# Altium project Micron-6.PrjPcb
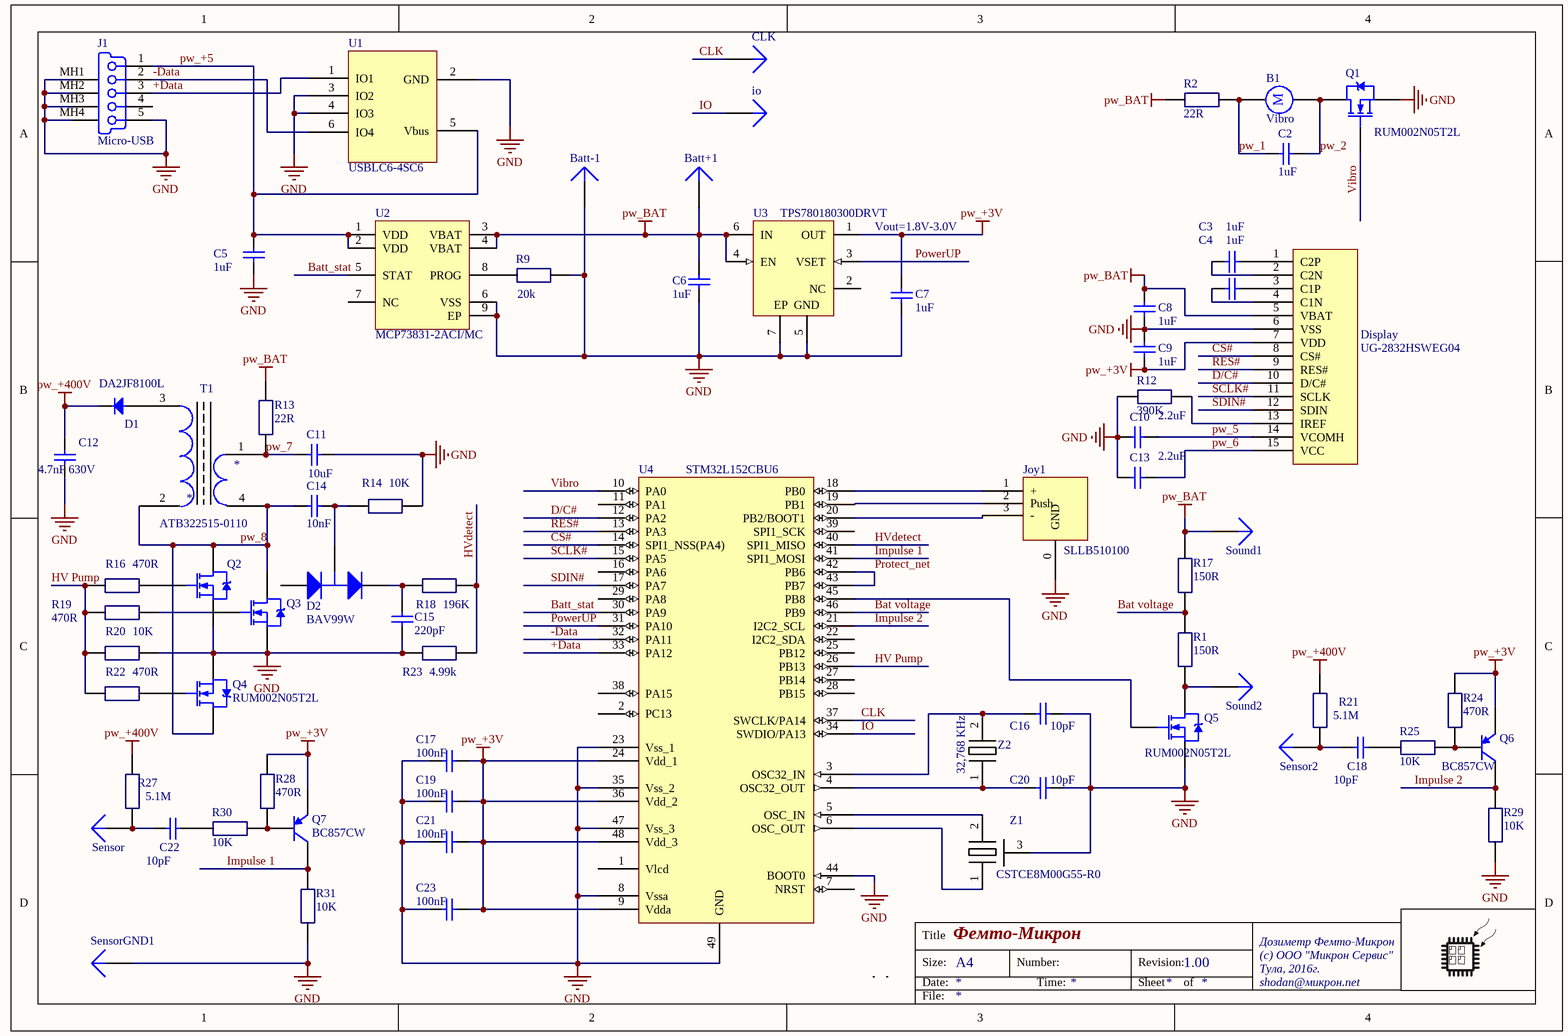
[diagram p0: Micron-6.SchDoc]
1 sheet, 74 parts. Net scope: global (net labels, ports and power ports of the same name join across sheets).
Board files: Micron-6_00_small border.PcbDoc, Rezonit_pannels.PcbDoc

## Sheet Micron-6.SchDoc: Фемто-Микрон
size A4; Date: 17.04.2016; Author: Andrey Bykanov; CompanyName: http://микрон.net; Engineer: Andrey Bykanov; Address1: Дозиметр Фемто-Микрон; Address2: (с) ООО "Микрон Сервис"; Address3: Тула, 2016г.; Address4: shodan@микрон.net; Revision: 1.00; PageSetup: Record=PageOptions|CenterHorizontal=False|CenterVertical=False|PrintScale=0.98|XCorrection=1.00|YCorrection=1.00|PrintKind=1|BorderSize=5000000|LeftOffset=0|BottomOffset=0|Orientation=2|PaperLength=1000|PaperWidth=1000|Scale=100|PaperSource=7|PrintQuality=-3|MediaType=1|DitherType=10|PrintScaleMode=0|PaperKind=A4|PaperIndex=9

### Parts
B1  Vibro  [Vibro 4hobby]
Batt+1  (no value)  [Sensor contact]  (no BOM)
Batt-1  (no value)  [Sensor contact]  (no BOM)
C2  1uF  [0402 AVX CHK2]
C3  1uF  [0402 AVX CHK2]
C4  1uF  [0402 AVX CHK2]
C5  1uF  [0402 AVX CHK2]
C6  1uF  [0402 AVX CHK2]
C7  1uF  [0402 AVX CHK2]
C8  1uF  [0402 AVX CHK2]
C9  1uF  [0402 AVX CHK2]
C10  2.2uF  [Yegeo 0603]
C11  10uF  [1608[0603]]
C12  4.7nF 630V  [C1206]
C13  2.2uF  [Yegeo 0603]
C14  10nF  [0402 AVX CHK2]
C15  220pF  [0402 AVX CHK2]
C16  10pF  [0402 AVX CHK2]
C17  100nF  [0402 AVX CHK2]
C18  10pF  [CC1206JRNPOBBN100]
C19  100nF  [0402 AVX CHK2]
C20  10pF  [0402 AVX CHK2]
C21  100nF  [0402 AVX CHK2]
C22  10pF  [CC1206JRNPOBBN100]
C23  100nF  [0402 AVX CHK2]
CLK  (no value)  [Sensor contact]  (no BOM)
D1  DA2JF8100L  [DA2JF8100L(chk)]
D2  BAV99W  [BAV99W]
Display  UG-2832HSWEG04  [UG-2832HSWEG04 - duplicate]
io  (no value)  [Sensor contact]  (no BOM)
J1  Micro-USB  [10118193-0001LF]
Joy1  SLLB510100  [SLLB510100]
Q1  RUM002N05T2L  [RUM002N05]
Q2  RUM002N05T2L  [RUM002N05]  (value not drawn)
Q3  RUM002N05T2L  [RUM002N05]  (value not drawn)
Q4  RUM002N05T2L  [RUM002N05]
Q5  RUM002N05T2L  [RUM002N05]
Q6  BC857CW  [SOT323_L2]
Q7  BC857CW  [SOT323_L2]
R1  150R  [0402 Yageo]
R2  22R  [0402 Yageo]
R9  20k  [0402 Yageo]
R12  390K  [0402 Yageo]
R13  22R  [0402 Yageo]
R14  10K  [0402 Yageo]
R16  470R  [0402 Yageo]
R17  150R  [0402 Yageo]
R18  196K  [0402 Yageo]
R19  470R  [0402 Yageo]
R20  10K  [0402 Yageo]
R21  5.1M  [Vishay RCV0805]
R22  470R  [0402 Yageo]
R23  4.99k  [0402 Yageo]
R24  470R  [0402 Yageo]
R25  10K  [0402 Yageo]
R27  5.1M  [Vishay RCV0805]
R28  470R  [0402 Yageo]
R29  10K  [0402 Yageo]
R30  10K  [0402 Yageo]
R31  10K  [0402 Yageo]
RP1  PR  [RP - minimum]  (value not drawn)  (no BOM)
RP2  PR  [RP - minimum]  (value not drawn)  (no BOM)
Sensor  (no value)  [Sensor contact]  (no BOM)
Sensor2  (no value)  [Sensor contact]  (no BOM)
SensorGND1  (no value)  [Sensor contact]  (no BOM)
Sound1  (no value)  [Sensor contact]  (no BOM)
Sound2  (no value)  [Sensor contact]  (no BOM)
T1  ATB322515-0110  [ATB322515-0110]
U1  USBLC6-4SC6  [USBLC6-4]
U2  MCP73831-2ACI/MC  [DFN-MC8]
U3  TPS780180300DRVT  [TI-DRV6-1600X1000TP_V]
U4  STM32L152CBU6  [STM32L152CBU6-small]
Z1  CSTCE8M00G55-R0  [CSTCE_G15C]
Z2  32,768 KHz  [ABS07-120-32.768kHz-T]

### Nets
GND: Batt-1.1 C5.1 C6.1 C7.1 C8.1 C9.2 C10.2 C11.1 C12.1 C13.2 C15.2 C16.1 C17.2 C19.2 C20.1 C21.2 C23.2 Display.6(VSS) J1.5(GND) J1.MH1(Tab) J1.MH2(Tab) J1.MH3(Tab) J1.MH4(Tab) Joy1.0(GND) Q1.2(S) Q2.2(S) Q3.2(S) Q4.2(S) Q5.2(S) R9.1(A) R12.1(A) R14.1(A) R20.1(A) R23.2 R29.2 R31.2 SensorGND1.1 U1.2(GND) U1.3(IO2) U1.4(IO3) U2.6(VSS) U2.9(EP) U3.5(GND) U3.7(EP) U4.8(Vssa) U4.23(Vss_1) U4.35(Vss_2) U4.44(BOOT0) U4.47(Vss_3) U4.49(GND) Z1.3
pw_+3V: C7.2 C9.1 C17.1 C19.1 C21.1 C23.1 Display.7(VDD) Q6.2(E) Q7.2(E) R24.1(A) R28.1(A) U3.1(OUT) U4.9(Vdda) U4.24(Vdd_1) U4.36(Vdd_2) U4.48(Vdd_3)
pw_+400V: C12.2 D1.1(C) R21.2 R27.2
pw_BAT: Batt+1.1 C6.2 C8.2 Display.5(VBAT) R2.1(A) R13.1(A) R17.1(A) Sound1.1 U2.3(VBAT) U2.4(VBAT) U3.4(EN) U3.6(IN)
+Data: J1.3(D+) U1.1(IO1) U4.33(PA12)
-Data: J1.2(D-) U1.6(IO4) U4.32(PA11)
Bat voltage: R1.1(A) R17.2 U4.46(PB9)
Batt_stat: U2.5(STAT) U4.30(PA9)
CLK: CLK.1 U4.37(SWCLK/PA14)
CS#: Display.8(CS#) U4.14(SPI1_NSS(PA4))
D/C#: Display.10(D/C#) U4.12(PA2)
HV Pump: R16.2 R19.2 R20.2 R22.2 U4.26(PB13)
HVdetect: R18.2 R23.1(A) U4.40(SPI1_MISO)
Impulse 1: Q7.3(C) R31.1(A) U4.41(SPI1_MOSI)
Impulse 2: Q6.3(C) R29.1(A) U4.21(I2C2_SCL)
IO: io.1 U4.34(SWDIO/PA13)
PowerUP: U3.3(VSET) U4.31(PA10)
Protect_net: U4.42(PB6) U4.43(PB7)
pw_1: B1.1 C2.2 R2.2
pw_2: B1.2 C2.1 Q1.3(D)
pw_5: C10.1 Display.14(VCOMH)
pw_6: C13.1 Display.15(VCC)
pw_7: C11.2 R13.2 T1.1
pw_8: C14.1 Q2.3(D) Q3.3(D) Q4.3(D) T1.2 T1.4
pw_+5: C5.2 J1.1(V_BUS_(5V)) U1.5(Vbus) U2.1(VDD) U2.2(VDD)
RES#: Display.9(RES#) U4.13(PA3)
SCLK#: Display.11(SCLK) U4.15(PA5)
SDIN#: Display.12(SDIN) U4.17(PA7)
Vibro: Q1.1(G) U4.10(PA0)
NetC3_1: C3.1 Display.1(C2P)
NetC3_2: C3.2 Display.2(C2N)
NetC4_1: C4.1 Display.3(C1P)
NetC4_2: C4.2 Display.4(C1N)
NetC14_2: C14.2 D2.3(C) R14.2
NetC15_1: C15.1 D2.2(K) R18.1(A)
NetC16_2: C16.2 U4.3(OSC32_IN) Z2.2
NetC18_1: C18.1 R25.1(A)
NetC18_2: C18.2 R21.1(A) Sensor2.1
NetC20_2: C20.2 U4.4(OSC32_OUT) Z2.1
NetC22_1: C22.1 R30.1(A)
NetC22_2: C22.2 R27.1(A) Sensor.1
NetD1_2: D1.2(A) T1.3
NetDisplay_13: Display.13(IREF) R12.2
NetJoy1_1: Joy1.1(+) U4.18(PB0)
NetJoy1_2: Joy1.2(Push) U4.19(PB1)
NetJoy1_3: Joy1.3(-) U4.20(PB2/BOOT1)
NetQ2_1: Q2.1(G) R16.1(A)
NetQ3_1: Q3.1(G) R19.1(A)
NetQ4_1: Q4.1(G) R22.1(A)
NetQ5_1: Q5.1(G) U4.45(PB8)
NetQ5_3: Q5.3(D) R1.2 Sound2.1
NetQ6_1: Q6.1(B) R24.2 R25.2
NetQ7_1: Q7.1(B) R28.2 R30.2
NetR9_2: R9.2 U2.8(PROG)
NetU4_5: U4.5(OSC_IN) Z1.2
NetU4_6: U4.6(OSC_OUT) Z1.1

Not connected (* = marked no-connect by the designer): D2 1(A); J1 4(NC); RP1 0; RP2 0; U2 7(NC); U3 2(NC); U4 1(Vlcd) 2(PC13) 7(NRST) 11(PA1) 16(PA6) 22(I2C2_SDA) 25(PB12) 27(PB14) 28(PB15) 29(PA8) 38(PA15) 39(SPI1_SCK)

### Notes on the sheet
- Vout=1.8V-3.0V
- Title
- Size:
- Date:
- A4
- Number:
- Time:
- Revision:
- Sheet
- of
- File:
- (in symbol Motor) M

### Library data of the parts
B1 = Motor: Motor, General Kind; Published: 24-Mar-1999; LatestRevisionDate: 17-Jul-2002; LatestRevisionNote: Re-released for DXP Platform.; PackageReference: RB5-10.5; Publisher: Altium Limited; PackageDescription: Capacitor (Radial); 2 Leads; Order: Vibro
Batt+1 = Plug: Order: EEMB LP401230; LatestRevisionDate: 17-Jul-2002; LatestRevisionNote: Re-released for DXP Platform.; Publisher: Altium Limited
Batt-1 CLK io SensorGND1 Sound2 = Plug: LatestRevisionDate: 17-Jul-2002; LatestRevisionNote: Re-released for DXP Platform.; Publisher: Altium Limited
C2-C4 C7-C9 = CAPACITOR: Capacitor (Semiconductor SIM Model); Order: GRM155R61A105KE15D; Ordered: 10000; Published: 8-Jun-2000; LatestRevisionDate: 29-May-2009; LatestRevisionNote: IPC-7351 Footprint Added.; PackageReference: C1206; Publisher: Altium Limited; PackageDescription: Chip Capacitor; Value: 1uF
C5 = Cap Semi: Capacitor (Semiconductor SIM Model); Order: GRM155R61A105KE15D; Avail: 1; Ordered: 10000; Published: 8-Jun-2000; LatestRevisionDate: 29-May-2009; LatestRevisionNote: IPC-7351 Footprint Added.; PackageReference: C1206; Publisher: Altium Limited; PackageDescription: Chip Capacitor; Value: 1uF
C6 = CAPACITOR: Capacitor (Semiconductor SIM Model); Order: GRM155R61A105KE15D; Avail: 1; Ordered: 10000; Published: 8-Jun-2000; LatestRevisionDate: 29-May-2009; LatestRevisionNote: IPC-7351 Footprint Added.; PackageReference: C1206; Publisher: Altium Limited; PackageDescription: Chip Capacitor; Value: 1uF
C10 C13 = CAPACITOR: Capacitor (Semiconductor SIM Model); Order: GRM188R61A225KE34D; Ordered: 4000; Published: 8-Jun-2000; LatestRevisionDate: 29-May-2009; LatestRevisionNote: IPC-7351 Footprint Added.; PackageReference: C1206; Publisher: Altium Limited; PackageDescription: Chip Capacitor; Value: 2.2uF
C11 = Cap Semi: Capacitor (Semiconductor SIM Model); Order: GRM188R60J106ME47D; Ordered: 4000; Published: 8-Jun-2000; LatestRevisionDate: 29-May-2009; LatestRevisionNote: IPC-7351 Footprint Added.; PackageReference: C1206; Publisher: Altium Limited; PackageDescription: Chip Capacitor; Value: 10uF
C12 = Cap Semi: Capacitor (Semiconductor SIM Model); Order: GRM31BR72J472KW01L; Ordered: 3000; Published: 8-Jun-2000; LatestRevisionDate: 29-May-2009; LatestRevisionNote: IPC-7351 Footprint Added.; PackageReference: C1206; Publisher: Altium Limited; PackageDescription: Chip Capacitor; Value: 4.7nF 630V
C14 = Cap Semi: Capacitor (Semiconductor SIM Model); Order: GRM155R71H103KA88D; Ordered: 10000; Value: 10nF
C15 = Cap Semi: Capacitor (Semiconductor SIM Model); Order: GRM1555C1H221JA01D; Ordered: 10000; Value: 220pF
C16 C20 = Cap Semi: Capacitor (Semiconductor SIM Model); Order: GRM1555C1H100JA01D; Ordered: 10000; Published: 8-Jun-2000; LatestRevisionDate: 29-May-2009; LatestRevisionNote: IPC-7351 Footprint Added.; PackageReference: C1206; Publisher: Altium Limited; PackageDescription: Chip Capacitor; Value: 10pF
C17 C19 C21 C23 = Cap Semi: Capacitor (Semiconductor SIM Model); Order: GRM155R61A104KA01D; Ordered: 10000; Published: 8-Jun-2000; LatestRevisionDate: 29-May-2009; LatestRevisionNote: IPC-7351 Footprint Added.; PackageReference: C1206; Publisher: Altium Limited; PackageDescription: Chip Capacitor; Value: 100nF
C18 C22 = Cap Semi: Capacitor (Semiconductor SIM Model); Ordered: 2419; Published: 8-Jun-2000; LatestRevisionDate: 29-May-2009; LatestRevisionNote: IPC-7351 Footprint Added.; PackageReference: C0805; Publisher: Altium Limited; PackageDescription: Chip Capacitor; Value: 10pF; Order: CC1206JRNPOBBN100
D1 = Diode: Ordered: 500; Order: DA2JF8100L
D2 = BAV99: Silicon Switching Diode Array for High-Speed Switching; Ordered: 3000; Published: 21-Mar-2003; DatasheetDocument: Oct-1999; PackageDocument: Sep-2001; PackageReference: SOT-23; Publisher: Altium Limited; ComponentLink1Description: Manufacturer Link; ComponentLink1URL: http://www.infineon.com/; ComponentLink2Description: Datasheet; ComponentLink2URL: http://www.infineon.com/upload/Document/cmc_upload/documents/080/631/bav99series_1.pdf; Value: BAV99W; Order: BAV99W
J1 = 0481900001: USB On-The-Go (OTG) Mini-B Receptacle, Right Angle, SMT, 0.80mm (.031") Pitch, Solder Tabs with Back Cover, Recessed Type; Order: 10118193-0001LF
Joy1 = Joystik: Order: SLLB510100
Q1-Q5 = IRLML2402: HEXFET Power MOSFET; Ordered: 8000; Published: 8-Jun-2000; LatestRevisionDate: 20-Nov-2009; LatestRevisionNote: IPC-7351 Footprint Added.; DatasheetVersion: Aug-1997; PackageReference: SOT-23; Publisher: Altium Limited; PackageDescription: 3-Pin SOT-23 Package 0.95 mm Pitch, 2.3 mm Lead Span; ComponentLink1Description: Manufacturer Link; ComponentLink1URL: http://www.irf.com/; ComponentLink2Description: Datasheet; ComponentLink2URL: http://www.irf.com/product-info/datasheets/data/irlml2402.pdf; Order: RUM002N05T2L; Value: RUM002N05T2L
Q6 Q7 = BC857CW: PNP General-purpose Transistor; Ordered: 3000; Published: 17-Sep-2003; LatestRevisionDate: 12-Dec-2006; LatestRevisionNote: IPC-7351 Footprint Added.; DatasheetVersion: 4-Feb-2002; PackageVersion: Apr-1999; PackageReference: SOT323; Publisher: Altium Limited; PackageDescription: 3-Pin SOT-323 Package 0.65 mm Pitch, 2.1 mm Lead Span; ComponentLink1Description: Manufacturer Link; ComponentLink1URL: http://www.semiconductors.philips.com/; ComponentLink2Description: Datasheet; ComponentLink2URL: http://www.semiconductors.philips.com/acrobat/datasheets/BC856W_BC857W_BC858W_4.pdf; Order: BC857CW
R1 R17 = Resistor 0805: Order: RC0402FR-07150RL; Ordered: 10000; Value: 150R
R2 = Resistor 0805: Order: RC0402FR-0722RL; Avail: 20; Min_order: 10000; Pack_price: 500; Value: 22R; Ordered: 10000
R9 = Resistor 0805: Order: RC0402FR-0720KL; Ordered: 10000; Value: 20k
R12 = Resistor 0805: Order: RC0402JR-07390KL; Ordered: 10000; Value: 390K
R13 = Resistor 0805: Order: RC0402FR-0722RL; Avail: 20; Ordered: 10000; Value: 22R
R14 R20 R29 R31 = Resistor 0805: Order: RC0402FR-0710KL; Ordered: 10000; Value: 10K
R16 R19 R22 R24 R28 = Resistor 0805: Order: RC0402FR-07470RL; Ordered: 10000; Value: 470R
R18 = Resistor 0805: Order: RC0402FR-07196KL; Ordered: 10000; Value: 196K
R21 R27 = Resistor 0805: Model: RC0805JR-075M1L; Ordered: 5000; Order: RC0805JR-075M1L; Value: 5.1M
R23 = Resistor 0805: Order: RC0402FR-074K99L; Ordered: 10000; Value: 4.99k
R25 R30 = Resistor 0805: Order: RC0402FR-0710KL; Avail: 1; Ordered: 10000; Value: 10K
Sensor Sensor2 = Plug: Order: SI-19BGM; LatestRevisionDate: 17-Jul-2002; LatestRevisionNote: Re-released for DXP Platform.; Publisher: Altium Limited
Sound1 = Plug: Order: 7BB-12-9; LatestRevisionDate: 17-Jul-2002; LatestRevisionNote: Re-released for DXP Platform.; Publisher: Altium Limited
T1 = ATB322515-0110: Order: ATB322524-0110; Value: FlayBack trans.
U1 = USBLC6-4SC6: Ordered: 1000; Order: USBLC6-4SC6
U2 = MCP73832T-2ACI/MC: =Order; Ordered: 300; Published: 29-Jan-2009; LatestRevisionDate: 27-Nov-2009; LatestRevisionNote: Updated to datasheet revision E, Sep-2008; DatasheetVersion: revE, Sep-2008; PackageVersion: revBB, Aug-2009; PackageReference: DFN-MC8; Publisher: Altium Limited; PackageDescription: 8-Lead Plastic Dual Flat, No Lead Package (MC) - 2x3x0.9mm Body [DFN]; Supplier 1: Digi-Key; Supplier Part Number 1: MCP73832T-2ACI/MC-ND; ComponentLink1Description: Datasheet; ComponentLink1URL: http://ww1.microchip.com/downloads/en/DeviceDoc/21984e.pdf; ComponentLink2Description: Packaging Specification; ComponentLink2URL: http://www.microchip.com/stellent/groups/techpub_sg/documents/packagingspec/en012702.pdf; ComponentLink3Description: Microchip.com Home; ComponentLink3URL: http://www.microchip.com/; Order: MCP73831-2ACI/MC
U3 = TPS780180300DRVT: Single Output LDO, 150 mA, Fixed 1.8, 3.0 V Output, 2.2 to 5.5 V Input, with Pin-Selectable, 6-pin SON (DRV), -40 to 125 degC, Green (RoHS & no Sb/Br); Manufacturer: Texas Instruments; Accuracy(%): 3; Iout(Max)(A): 0.15; Iq(Typ)(mA): 0.0005; SubFamily: Single Channel LDO; Vdo(Typ)(mV): 200; Vin(Max)(V): 5.5; Vin(Min)(V): 2.2; Ordered: 250; DatasheetVersion: SBVS083D; PackageVersion: 4206925/E; PackageReference: DRV6-1600X1000TP; PackageDescription: 6-Pin Plastic Small Outline No-Lead, Body 2 x 2 mm, Pitch 0.65 mm; Supplier 1: Digi-Key; Supplier Part Number 1: TPS780180300DRVT-ND; Supplier 2: Mouser; Supplier Part Number 2: 595-TPS780180300DRVT; Eco-Plan: Green (RoHS & no Sb/Br); Fixed Output Options(V): 1.8, 3.0; Mounting Technology: Surface Mount; PartNumber: TPS780180300DRVT; ComponentLink1Description: Manufacturer URL; ComponentLink1URL: http://www.ti.com/; ComponentLink2Description: Datasheet; ComponentLink2URL: http://www.ti.com/general/docs/lit/getliterature.tsp?genericPartNumber=TPS780180300&fileType=pdf; ComponentLink3Description: Package Specification; ComponentLink3URL: http://www.ti.com/litv/pdf/mpds216d; Order: TPS780180300DRVT; Value: TPS780180300DRVT
U4 = STM32L152CBU6: Ordered: 200; Order: STM32L152CBU6
Z1 = 8MHZ_cap: Ordered: 250; Order: CSTCE8M00G55-R0; Value: CSTCE8M00G55-R0
Z2 = 8MHZ: Order: ABS07-120-32.768kHz-T; Value: 32,768 KHz
Display = UG-2832HSWEG04: Order: UG-2832HSWEG04; Value: UG-2832HSWEG04